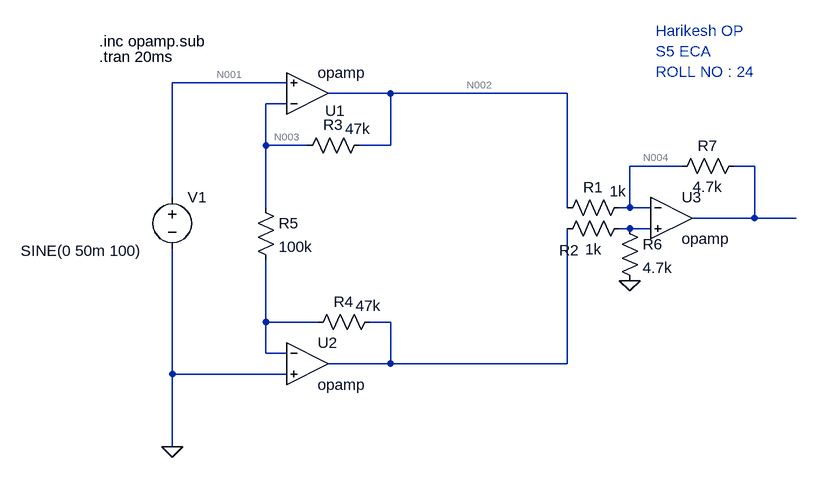
[diagram p0: schematic INSTRUMENTATION.asc]
INSTRUMENTATION.asc, the LTspice schematic file:
Version 4
SHEET 1 880 680
WIRE 48 96 -128 96
WIRE 208 112 112 112
WIRE 480 112 208 112
WIRE 48 128 16 128
WIRE 16 192 16 128
WIRE 80 192 16 192
WIRE 208 192 208 112
WIRE 208 192 160 192
WIRE 656 224 576 224
WIRE 768 224 736 224
WIRE -128 272 -128 96
WIRE 16 288 16 192
WIRE 480 288 480 112
WIRE 576 288 576 224
WIRE 576 288 560 288
WIRE 608 288 576 288
WIRE 768 304 768 224
WIRE 768 304 672 304
WIRE 832 304 768 304
WIRE 576 320 560 320
WIRE 608 320 576 320
WIRE 16 464 16 368
WIRE 96 464 16 464
WIRE 208 464 176 464
WIRE 16 512 16 464
WIRE 48 512 16 512
WIRE 208 528 208 464
WIRE 208 528 112 528
WIRE 480 528 480 320
WIRE 480 528 208 528
WIRE -128 544 -128 352
WIRE 48 544 -128 544
WIRE -128 656 -128 544
FLAG 576 400 0
FLAG -128 656 0
SYMBOL OpAmps\\opamp 80 176 M180
WINDOW 0 27 37 Left 2
SYMATTR InstName U1
SYMBOL OpAmps\\opamp 80 464 R0
SYMATTR InstName U2
SYMBOL OpAmps\\opamp 640 240 R0
SYMATTR InstName U3
SYMBOL res 576 272 R90
WINDOW 0 0 56 VBottom 2
WINDOW 3 -25 18 VTop 2
SYMATTR InstName R1
SYMATTR Value 1k
SYMBOL res 576 304 R90
WINDOW 0 65 93 VBottom 2
WINDOW 3 32 56 VTop 2
SYMATTR InstName R2
SYMATTR Value 1k
SYMBOL res 176 176 R90
WINDOW 0 0 56 VBottom 2
WINDOW 3 -25 18 VTop 2
SYMATTR InstName R3
SYMATTR Value 47k
SYMBOL res 192 448 R90
WINDOW 0 0 56 VBottom 2
WINDOW 3 -25 18 VTop 2
SYMATTR InstName R4
SYMATTR Value 47k
SYMBOL res 0 272 R0
SYMATTR InstName R5
SYMATTR Value 100k
SYMBOL res 560 304 R0
SYMATTR InstName R6
SYMATTR Value 4.7k
SYMBOL res 752 208 R90
WINDOW 0 0 56 VBottom 2
WINDOW 3 32 56 VTop 2
SYMATTR InstName R7
SYMATTR Value 4.7k
SYMBOL voltage -128 256 R0
WINDOW 3 -233 98 Left 2
WINDOW 123 0 0 Left 0
WINDOW 39 0 0 Left 0
SYMATTR InstName V1
SYMATTR Value SINE(0 50m 100)
TEXT 616 16 Left 2 ;Harikesh OP\nS5 ECA \nROLL NO : 24
TEXT -240 32 Left 2 !.inc opamp.sub
TEXT -240 56 Left 2 !.tran 20ms

The netlist it stands for:
* INSTRUMENTATION.asc
XU1 N003 N001 N002 opamp Aol=100K GBW=10Meg  ; pins invin noninvin out
XU2 N007 0 N008 opamp Aol=100K GBW=10Meg  ; pins invin noninvin out
XU3 N004 N006 N005 opamp Aol=100K GBW=10Meg  ; pins invin noninvin out
R1 N004 N002 1k
R2 N006 N008 1k
R3 N002 N003 47k
R4 N008 N007 47k
R5 N003 N007 100k
R6 N006 0 4.7k
R7 N005 N004 4.7k
V1 N001 0 SINE(0 50m 100)
* Harikesh OP
* S5 ECA
* ROLL NO : 24
.inc opamp.sub
.tran 20ms
.backanno
.end

* Results of the author's LTspice run, read from the files saved beside the schematic
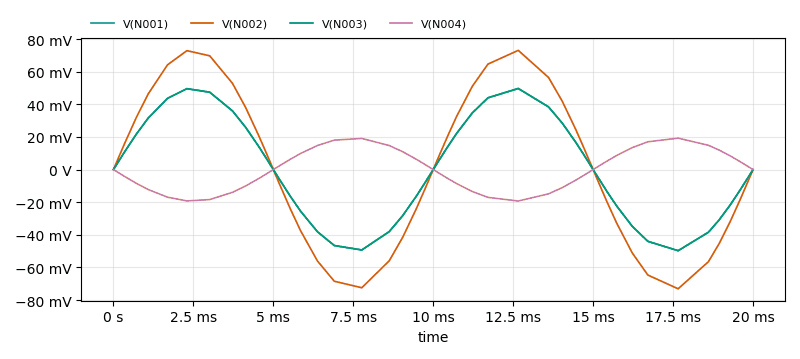
[diagram p1: Transient Analysis of INSTRUMENTATION.asc, plotted from the saved traces]
* Transient Analysis, 1 run:
*   V(N001): min -49.71 mV, max 49.71 mV, average 27.47 µV, rms 34.89 mV, last 0 V
*   V(N002): min -73.08 mV, max 73.08 mV, average 40.38 µV, rms 51.29 mV, last -1.191 µV
*   V(N003): min -49.71 mV, max 49.71 mV, average 27.47 µV, rms 34.89 mV, last -735 nV
*   V(N004): min -19.26 mV, max 19.26 mV, average -10.64 µV, rms 13.52 mV, last 5.128 µV